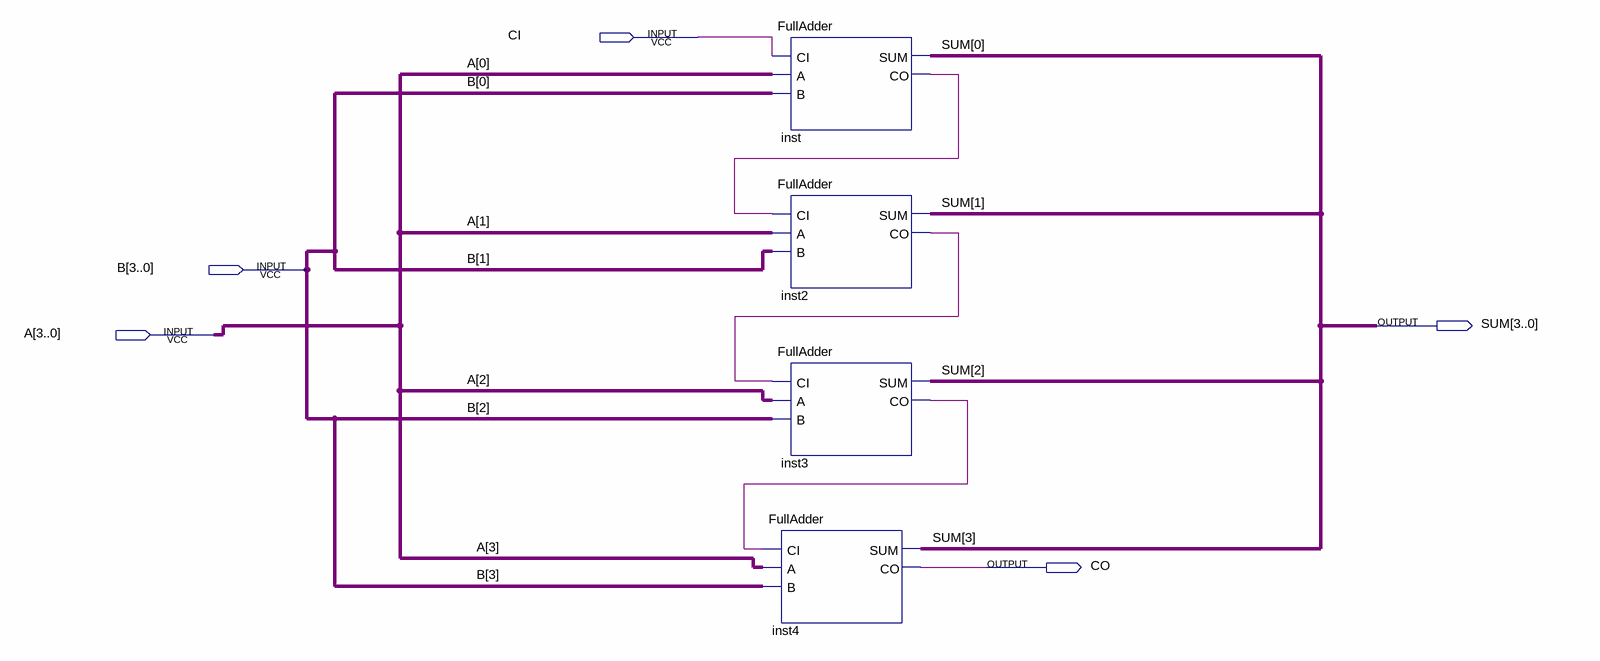
[diagram p0: schematic sheet]
// Quartus schematic RippleCarryAdder.bdf as structural Verilog: 4 symbols, 5 pins
module RippleCarryAdder (
  input  CI,
  input  [3:0] B,
  input  [3:0] A,
  output [3:0] SUM,
  output CO
);

  wire inst2_co, inst3_co, inst_co;

  FullAdder inst (.CI(CI), .A(A[0]), .B(B[0]), .SUM(SUM[0]), .CO(inst_co));
  FullAdder inst2 (.CI(inst_co), .A(A[1]), .B(B[1]), .SUM(SUM[1]), .CO(inst2_co));
  FullAdder inst3 (.CI(inst2_co), .A(A[2]), .B(B[2]), .SUM(SUM[2]), .CO(inst3_co));
  FullAdder inst4 (.CI(inst3_co), .A(A[3]), .B(B[3]), .SUM(SUM[3]), .CO(CO));
endmodule
